# Altium schematic sheet LCD.SchDoc: LCD
size A3; Date: 3/31/2015; Author: P.A.; CompanyName: STMicroelectronics; Organization: Microcontrollers Division; Address1: 12, Rue Jules HOROWITZ; Address2: 38019 Grenoble; Address3: FRANCE; DocumentNumber: MB1209; Revision: D-02; SheetNumber: 4; SheetTotal: 11; Project: STM32F412G-DISCO; ModifiedDate: 6/2/2016
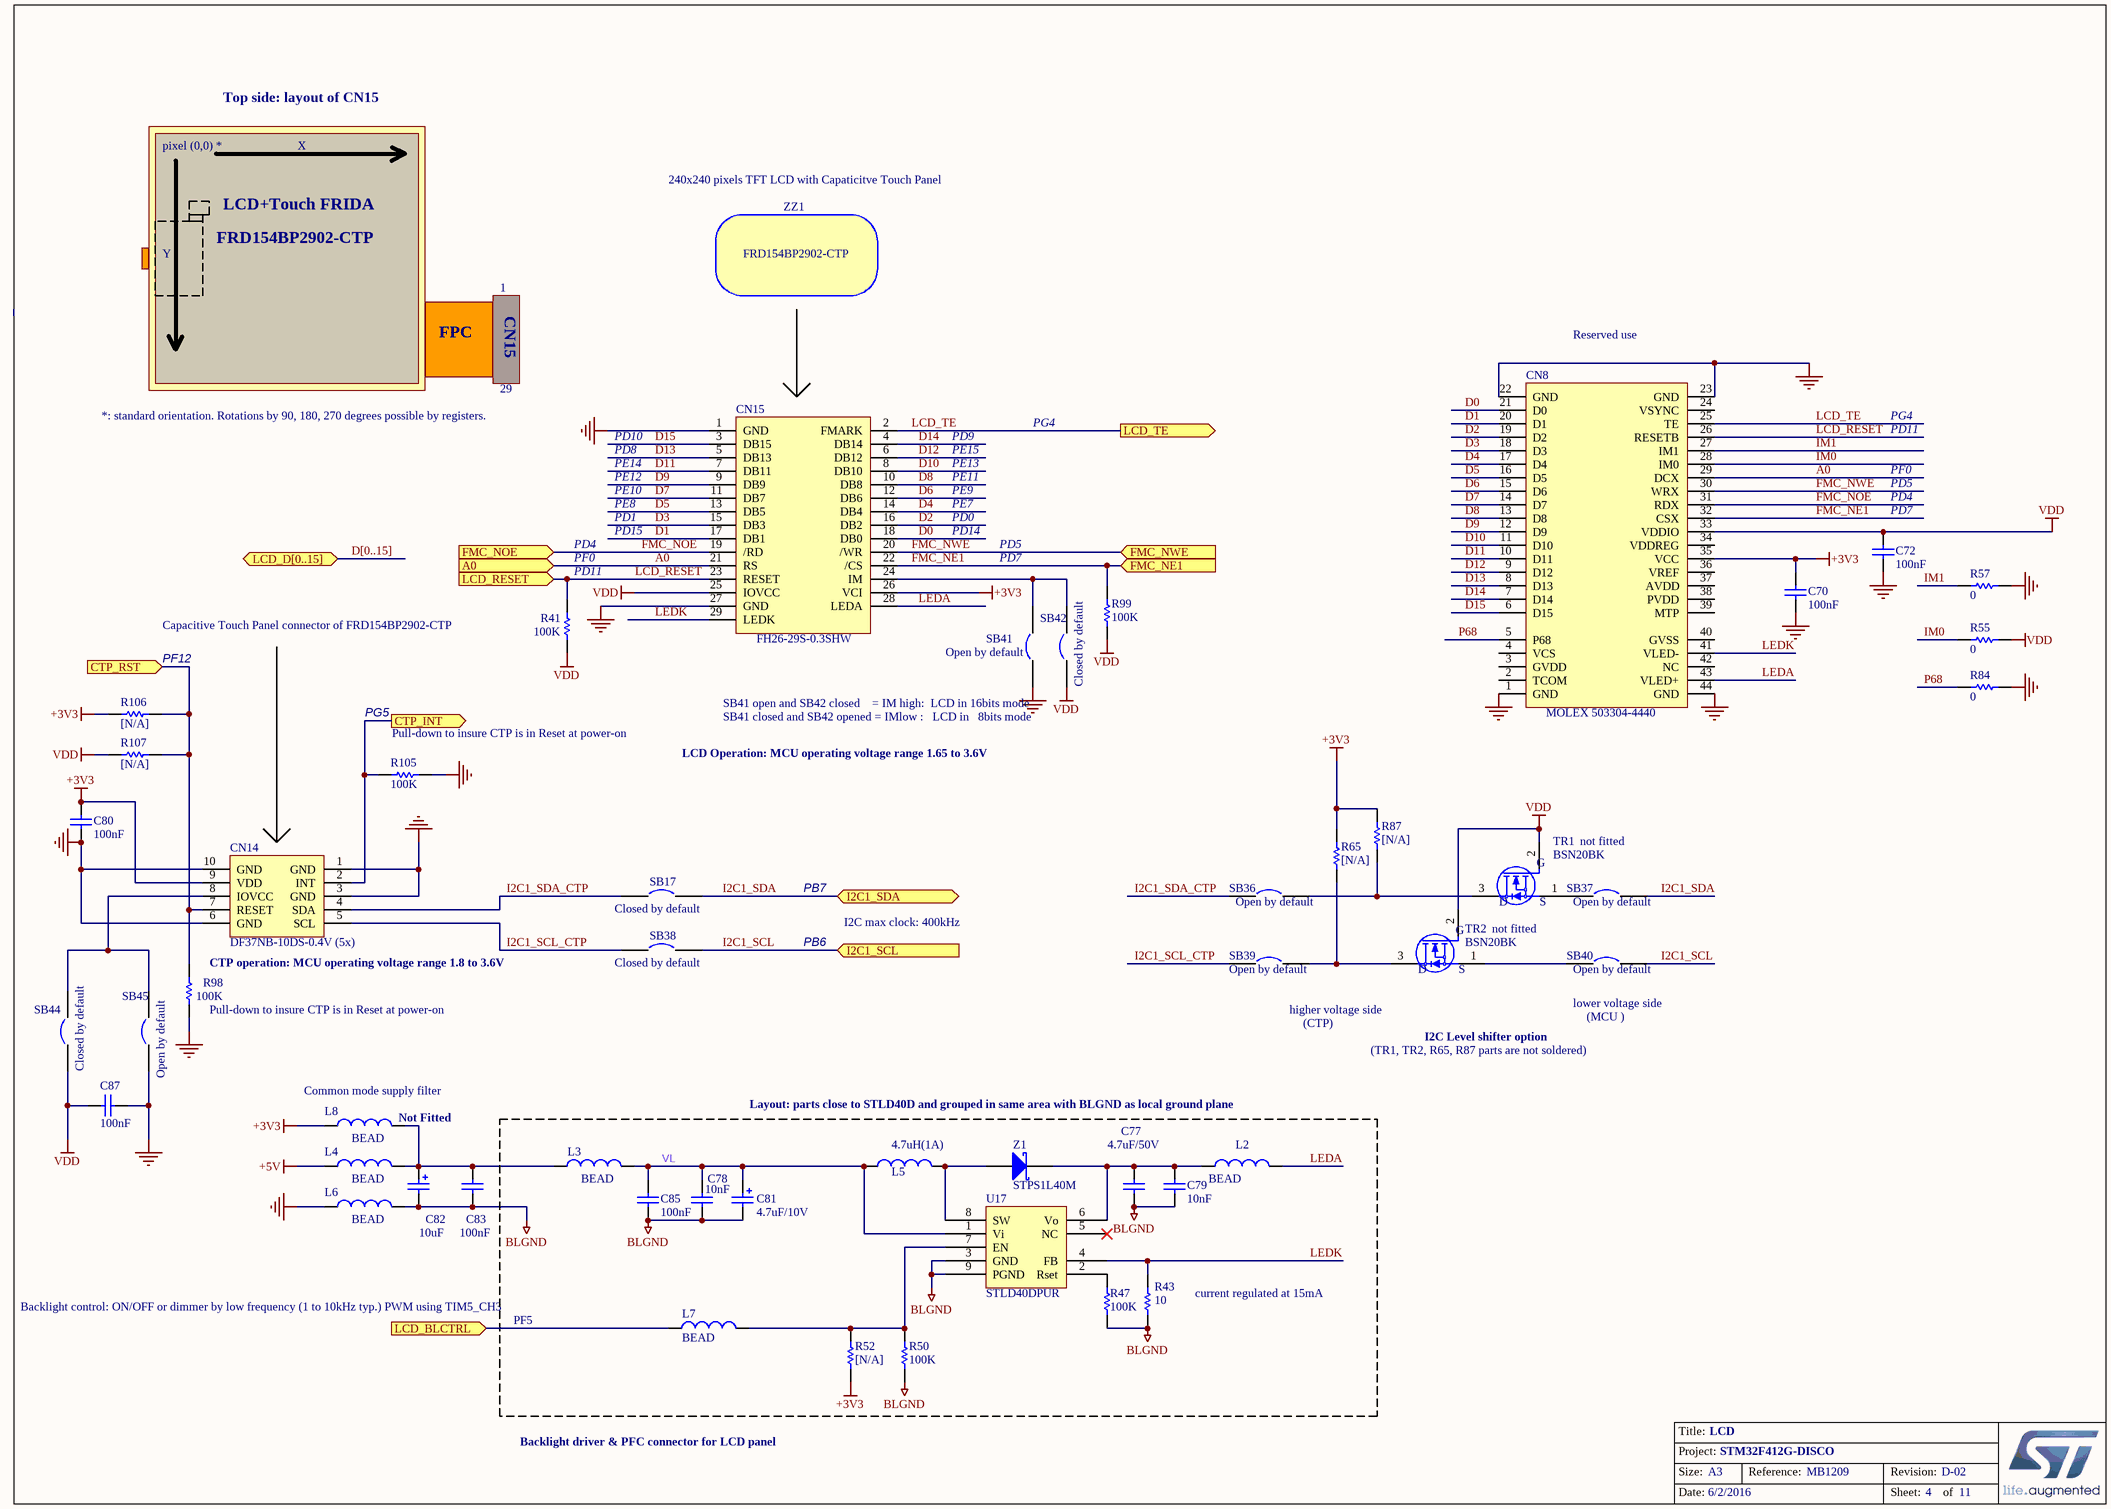
[diagram p0: LCD.SchDoc]

## Parts
C70  100nF  [0402C]
C72  100nF  [0402C]
C77  4.7uF/50V  [1206C]
C78  10nF  [0603C]
C79  10nF  [0603C]
C80  100nF  [0402C]
C81  4.7uF/10V  [1206C]
C82  10uF  [TAN-A]
C83  100nF  [0402C]
C85  100nF  [0402C]
C87  100nF  [0402C]
CN8  MOLEX 503304-4440  [MOLEX_503304-4440]
CN14  DF37NB-10DS-0.4V (5x)  [DF37NB-10DS-0R4V]
CN15  FH26-29S-0.3SHW  [FH26-29S-0R3SHW]
L2  BEAD  [0603L]
L3  BEAD  [0603L]
L4  BEAD  [0603L]
L5  4.7uH(1A)  [1210L]
L6  BEAD  [0603L]
L7  BEAD  [0603L]
L8  BEAD  [0603L]
R41  100K  [0402R]
R43  10  [0603R]
R47  100K  [0402R]
R50  100K  [0402R]
R52  [N/A]  [0603R]
R55  0  [0402R]
R57  0  [0402R]
R65  [N/A]  [0603R]
R84  0  [0402R]
R87  [N/A]  [0603R]
R98  100K  [0402R]
R99  100K  [0402R]
R105  100K  [0402R]
R106  [N/A]  [0402R]
R107  [N/A]  [0402R]
SB17  Closed by default  [SB_0603]
SB36  Open by default  [SB_0603]
SB37  Open by default  [SB_0603]
SB38  Closed by default  [SB_0603]
SB39  Open by default  [SB_0603]
SB40  Open by default  [SB_0603]
SB41  Open by default  [SB_0603]
SB42  Closed by default  [SB_0603]
SB44  Closed by default  [SB_0603]
SB45  Open by default  [SB_0603]
TR1  BSN20BK  [SOT23-213]
TR2  BSN20BK  [SOT23-213]
U17  STLD40DPUR  [SON8_0R65_3X3]
Z1  STPS1L40M  [DO-216AA]
ZZ1  FRD154BP2902-CTP

## Ports
A0 (in), CTP_INT (out), CTP_RST (in), FMC_NE1 (in), FMC_NOE (in), FMC_NWE (in), I2C1_SCL (in), I2C1_SDA (bidir), LCD_BLCTRL (in), LCD_D[0..15] (bidir), LCD_RESET (in), LCD_TE (out)

## Nets
+3V3: C70.1 C80.2 CN8.35(VCC) CN14.9(VDD) CN15.26(VCI) L8.1 R52.1 R65.2 R87.2 R106.1
+5V: L4.1
BLGND: C77.2 C78.1 C79.1 C81.2 C82.2 C83.2 C85.1 L6.2 R43.1 R47.2 R50.1 U17.3(GND) U17.9(PGND)
GND: C70.2 C72.2 C80.1 C87.1 CN8.1(GND) CN8.22(GND) CN8.23(GND) CN8.44(GND) CN14.1(GND) CN14.3(GND) CN14.6(GND) CN14.10(GND) CN15.1(GND) CN15.27(GND) L6.1 R57.1 R84.1 R98.2 R105.2 SB41.1 SB45.1
VDD: C72.1 C87.2 CN8.33(VDDIO) CN15.25(IOVCC) R41.1 R55.1 R99.2 R107.1 SB42.1 SB44.1 TR1.2(G) TR2.2(G)
A0: CN8.29(DCX) CN15.21(RS) ; port A0
CTP_INT: CN14.2(INT) R105.1 ; port CTP_INT
CTP_RST: CN14.7(RESET) R98.1 R106.2 R107.2 ; port CTP_RST
D0: CN8.21(D0) CN15.18(DB0)
D1: CN8.20(D1) CN15.17(DB1)
D2: CN8.19(D2) CN15.16(DB2)
D3: CN8.18(D3) CN15.15(DB3)
D4: CN8.17(D4) CN15.14(DB4)
D5: CN8.16(D5) CN15.13(DB5)
D6: CN8.15(D6) CN15.12(DB6)
D7: CN8.14(D7) CN15.11(DB7)
D8: CN8.13(D8) CN15.10(DB8)
D9: CN8.12(D9) CN15.9(DB9)
D10: CN8.11(D10) CN15.8(DB10)
D11: CN8.10(D11) CN15.7(DB11)
D12: CN8.9(D12) CN15.6(DB12)
D13: CN8.8(D13) CN15.5(DB13)
D14: CN8.7(D14) CN15.4(DB14)
D15: CN8.6(D15) CN15.3(DB15)
FMC_NE1: CN8.32(CSX) CN15.22(/CS) R99.1 ; port FMC_NE1
FMC_NOE: CN8.31(RDX) CN15.19(/RD) ; port FMC_NOE
FMC_NWE: CN8.30(WRX) CN15.20(/WR) ; port FMC_NWE
I2C1_SCL: SB38.2 SB40.2 ; port I2C1_SCL
I2C1_SCL_CTP: CN14.5(SCL) SB38.1 SB39.1
I2C1_SDA: SB17.2 SB37.2 ; port I2C1_SDA
I2C1_SDA_CTP: CN14.4(SDA) SB17.1 SB36.1
IM0: CN8.28(IM0) R55.2
IM1: CN8.27(IM1) R57.2
LCD_BLCTRL: L7.1 ; port LCD_BLCTRL
LCD_RESET: CN8.26(RESETB) CN15.23(RESET) R41.2 ; port LCD_RESET
LCD_TE: CN8.25(TE) CN15.2(FMARK) ; port LCD_TE
LEDA: CN8.43(VLED+) CN15.28(LEDA) L2.2
LEDK: CN8.41(VLED-) CN15.29(LEDK) R43.2 U17.4(FB)
P68: CN8.5(P68) R84.2
VL: C78.2 C81.1 C85.2 L3.2 L5.1 U17.1(Vi)
NetC77_1: C77.1 C79.2 L2.1 U17.6(Vo) Z1.2(K)
NetC82_1: C82.1 C83.1 L3.1 L4.2 L8.2
NetCN14_8: CN14.8(IOVCC) SB44.2 SB45.2
NetCN15_24: CN15.24(IM) SB41.2 SB42.2
NetL5_2: L5.2 U17.8(SW) Z1.1(A)
NetL7_2: L7.2 R50.2 R52.2 U17.7(EN)
NetR47_1: R47.1 U17.2(Rset)
NetR65_1: R65.1 SB39.2 TR2.3(D)
NetR87_1: R87.1 SB36.2 TR1.3(D)
NetSB37_1: SB37.1 TR1.1(S)
NetSB40_1: SB40.1 TR2.1(S)

Not connected (* = marked no-connect by the designer): CN8 2(TCOM) 3(GVDD) 4(VCS) 24(VSYNC) 34(VDDREG) 36(VREF) 37(AVDD) 38(PVDD) 39(MTP) 40(GVSS) 42(NC); U17 5(NC)*

## Buses and harness runs
bus D[0..15] = port LCD_D[0..15]

## Notes on the sheet
- Top side: layout of CN15
- pixel (0,0) *
- X
- 240x240 pixels TFT LCD with Capaticitve Touch Panel
- FRD154BP2902-CTP
- LCD+Touch FRIDA
- Y
- 1
- CN15
- FPC
- Reserved use
- *: standard orientation. Rotations by 90, 180, 270 degrees possible by registers.
- 29
- PD8
- PD10
- PE15
- PD9
- PG4
- PD11
- PE8
- PE10
- PE12
- PE14
- PE7
- PE9
- PE11
- PE13
- PD5
- (near C72) PD4
- (near C72) PD7
- PF0
- (near R41) PD11
- PD4
- (near R41) PF0
- PD15
- PD1
- PD14
- PD0
- PD7
- Capacitive Touch Panel connector of FRD154BP2902-CTP
- (near R106) PF12
- PG5
- (near R105) Pull-down to insure CTP is in Reset at power-on
- LCD Operation: MCU operating voltage range 1.65 to 3.6V
- SB41 open and SB42 closed    = IM high:  LCD in 16bits mode
  SB41 closed and SB42 opened = IMlow :   LCD in   8bits mode
- not fitted
- PB7
- CTP operation: MCU operating voltage range 1.8 to 3.6V
- PB6
- I2C max clock: 400kHz
- (near R98) Pull-down to insure CTP is in Reset at power-on
- higher voltage side
- (CTP)
- (TR1, TR2, R65, R87 parts are not soldered)
- I2C Level shifter option
- (near SB40) lower voltage side
- (near SB40) (MCU )
- (near L8) Common mode supply filter
- (near L8) Not Fitted
- Layout: parts close to STLD40D and grouped in same area with BLGND as local ground plane
- Backlight control: ON/OFF or dimmer by low frequency (1 to 10kHz typ.) PWM using TIM5_CH3
- PF5
- (near R43) current regulated at 15mA
- Backlight driver & PFC connector for LCD panel
- Title:
- Project:
- Size:
- Date:
- A3
- Reference:
- Sheet:
- Revision:
- of

## Library data of the parts
C70 C72 = CAP: Capacitor; Ordered by: Subcon; ECCN_US/EU: NA; Published: 8-Jun-2000; Revision: July-2002: Re-released for DXP Platform.; Publisher: Altium Limited; Value: 100nF
C77-C80 C85 C87 = CAP: Capacitor; Value: 100pF; Ordered by: Subcon; ECCN_US/EU: NA; Published: 8-Jun-2000; Revision: July-2002: Re-released for DXP Platform.; Publisher: Altium Limited
C81 = Cap Pol1: Polarized Capacitor (Radial); Value: 100pF; Ordered by: Subcon; ECCN_US/EU: NA; Published: 8-Jun-2000; Revision: July-2002: Re-released for DXP Platform.; Publisher: Altium Limited
C82 = Cap Pol1: Polarized Capacitor (Radial); Ordered by: Subcon; ECCN_US/EU: NA; Published: 8-Jun-2000; Revision: July-2002: Re-released for DXP Platform.; Publisher: Altium Limited; Value: 10uF
C83 = Cap: Capacitor; Value: 10nF; Ordered by: Subcon; ECCN_US/EU: NA; Published: 8-Jun-2000; Revision: July-2002: Re-released for DXP Platform.; Publisher: Altium Limited
CN8 = MOLEX 503304-4410: LCD FCP BtoB receptacle; Ordered by: Subcon; Assembly: with LCD Sharp; ECCN_US/EU: NA; Manuf_1: MOLEX; Manuf_Part_1: 503304-4440; Silkscreen: LCD
CN14 = Header 5X2A: Header, 5-Pin, Dual row; Manuf_1: Hirose; Ordered by: Subcon; ECCN_US/EU: NA; LatestRevisionDate: 17-Jul-2002; LatestRevisionNote: Re-released for DXP Platform.; Publisher: Altium Limited; Manuf_Part_1: DF37NB-10DS-0.4V (5x)
CN15 = FH26-29S-0.3SHW: 29pins FPC connector; Manuf_1: Hirose; Ordered by: Subcon; ECCN_US/EU: NA; Manuf_Part_1: FH26-29S-0.3SHW
L2-L4 L6 L7 = Inductor: Manuf_1: Tai-tech; Manuf_Part_1: FCM1608KF-601T03; Value: 100uH; Ordered by: Subcon; ECCN_US/EU: NA; Published: 8-Jun-2000; Revision: July-2002: Re-released for DXP Platform.; Publisher: Altium Limited
L5 = Inductor: Value: 100uH; Ordered by: Subcon; ECCN_US/EU: NA; Published: 8-Jun-2000; Revision: July-2002: Re-released for DXP Platform.; Publisher: Altium Limited
L8 = Inductor: Manuf_1: Tai-tech; Manuf_Part_1: FCM1608KF-601T03; Value: 100uH; Ordered by: Subcon; ECCN_US/EU: NA; Fitted: NO; Published: 8-Jun-2000; Revision: July-2002: Re-released for DXP Platform.; Publisher: Altium Limited
R41 R43 R47 R50 R55 R57 R84 R99 = Res1: Resistor; Value: 1K; Ordered by: Subcon; ECCN_US/EU: NA; Published: 8-Jun-2000; Revision: July-2002: Re-released for DXP Platform.; Publisher: Altium Limited
R52 = Res1: Resistor; Value: 1K; Ordered by: Subcon; Fitted: NO; ECCN_US/EU: NA; Published: 8-Jun-2000; Revision: July-2002: Re-released for DXP Platform.; Publisher: Altium Limited
R65 R87 = Res1: Resistor; Value: 1K; Ordered by: Subcon; ECCN_US/EU: NA; Fitted: NO; Published: 8-Jun-2000; Revision: July-2002: Re-released for DXP Platform.; Publisher: Altium Limited
R98 R105-R107 = res1: Resistor; Value: 1K; Ordered by: Subcon; ECCN_US/EU: NA; Published: 8-Jun-2000; Revision: July-2002: Re-released for DXP Platform.; Publisher: Altium Limited
SB17 SB38 SB42 SB44 = Circuit Breaker: Ordered by: Subcon; Comments: Solder bridge; ECCN_US/EU: NA; Published: 24-Mar-1999; Revision: July-2002: Re-released for DXP Platform.; Publisher: Altium Limited
SB36 SB37 SB39-SB41 SB45 = Circuit Breaker: Ordered by: Subcon; Comments: Solder bridge; Fitted: NO; ECCN_US/EU: NA; Published: 24-Mar-1999; Revision: July-2002: Re-released for DXP Platform.; Publisher: Altium Limited
TR1 TR2 = 2N7000: Manuf_1: NXP; Manuf_Part_2: BSN20; ECCN_US/EU: EAR99/NEC; Ordered by: Subcon; Fitted: NO; Manuf_2: NXP; Manuf_Part_1: BSN20BK
U17 = STLD40DPMR: Ordered by: ST; Ref St: 9176009; ECCN_US/EU: EAR99/NEC; Manuf_1: ST; Manuf_Part_1: STLD40DPUR
Z1 = D Schottky: Schottky Diode; Code - JEDEC: DO-214-AA; Ordered by: ST; Ref St: 9151085; ECCN_US/EU: EAR99/NEC; Published: 8-Jun-2000; Revision: July-2002: Re-released for DXP Platform.; Publisher: Altium Limited; Manuf_1: ST; Manuf_Part_1: STPS1L40M
ZZ1 = BoM_Item: Manuf_1: FRIDA; Ordered by: Subcon; ECCN_US/EU: EAR99/NEC; Manuf_Part_1: FRD154BP2902-CTP